# Altium schematic sheet [01] - COVER PAGE.SchDoc: Test title
size A4; Projectnumber: OWN-000; Project name:: Test name; Client: DSG; Date: YYYY-MM-DD; CheckedBy: Bartosz Kowierski; DrawnBy: Paweł Poryzała; Engineer: X; Revision: 0.9; Size: A4; Contact: datasystem.pl
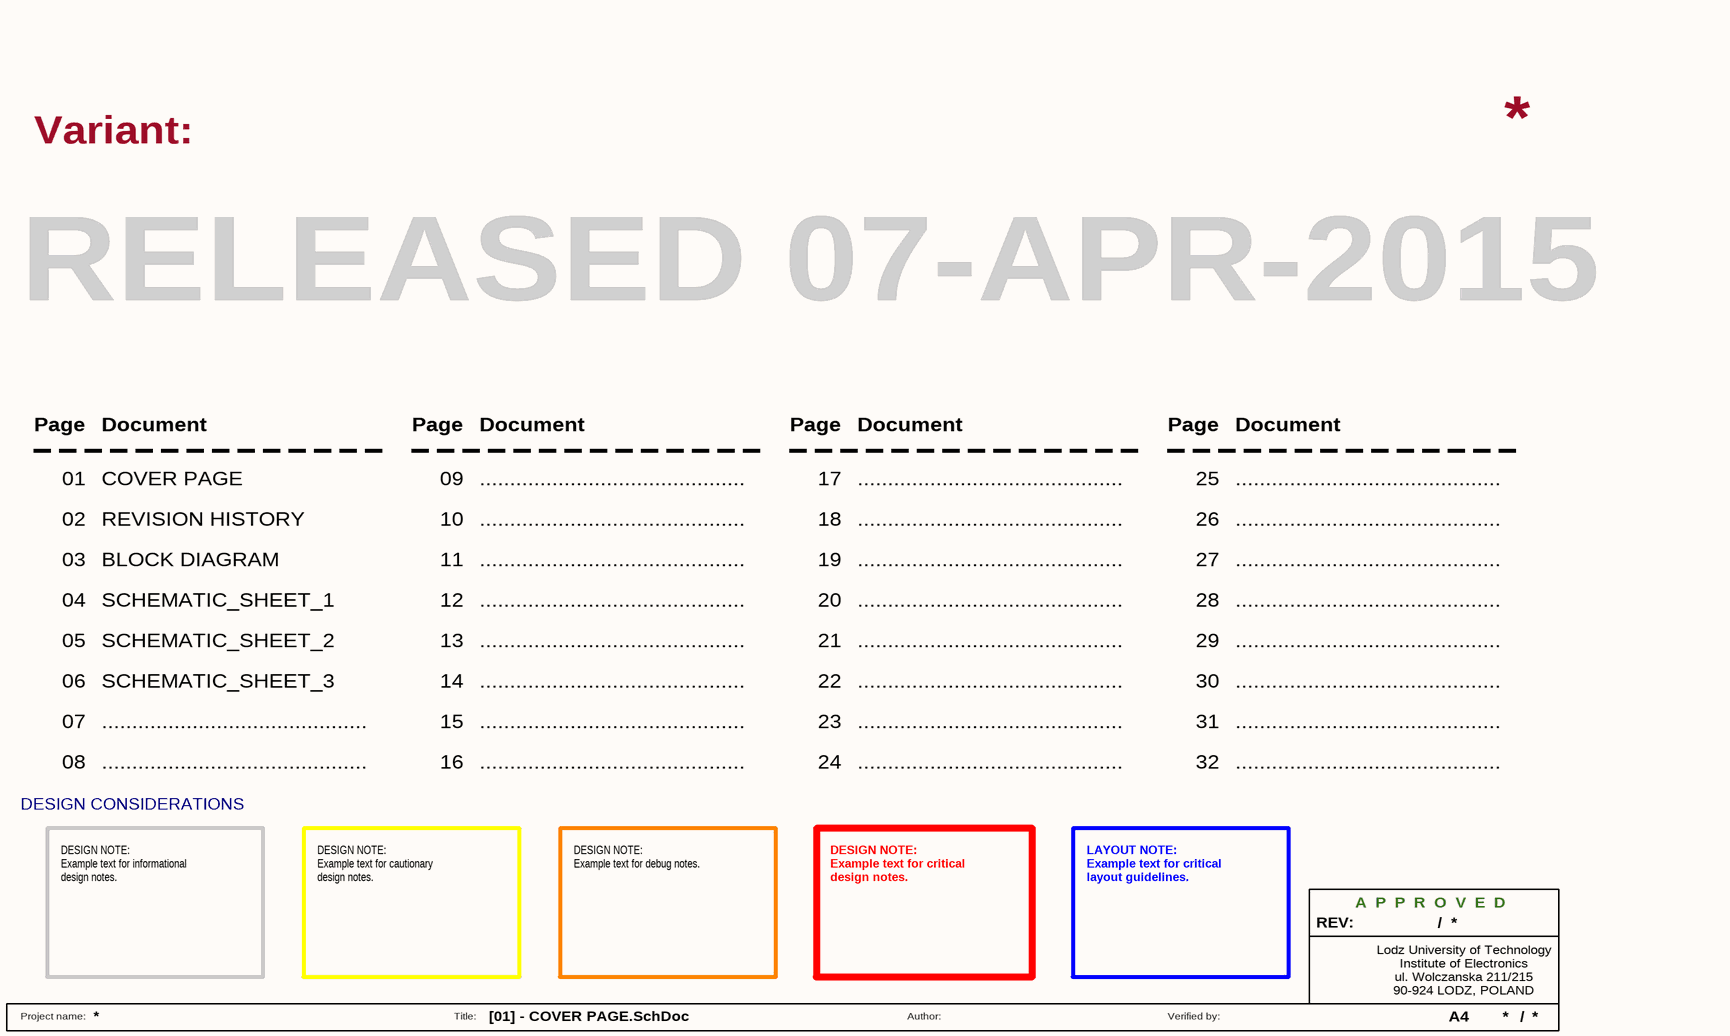
[diagram p0: [01] - COVER PAGE.SchDoc]

## Notes on the sheet
- Variant:
- RELEASED 07-APR-2015
- Page
- Document
- 01
- COVER PAGE
- 09
- ............................................
- 17
- 25
- 02
- 03
- REVISION HISTORY
- BLOCK DIAGRAM
- 10
- 11
- 18
- 19
- 26
- 27
- 04
- 05
- SCHEMATIC_SHEET_1
- SCHEMATIC_SHEET_2
- 12
- 13
- 20
- 21
- 28
- 29
- 06
- SCHEMATIC_SHEET_3
- 14
- 22
- 30
- 07
- 08
- 15
- 16
- 23
- 24
- 31
- 32
- DESIGN CONSIDERATIONS
- DESIGN NOTE:
  Example text for informational
  design notes.
- DESIGN NOTE:
  Example text for cautionary
  design notes.
- DESIGN NOTE:
  Example text for debug notes.
- DESIGN NOTE:
  Example text for critical
  design notes.
- LAYOUT NOTE:
  Example text for critical
  layout guidelines.
- REV:
- A  P  P  R  O  V  E  D
- /
- Lodz University of Technology
- ul. Wolczanska 211/215
- 90-924 LODZ, POLAND
- Institute of Electronics
- Project name:
- Title:
- Author:
- Verified by: